# Altium schematic sheet 03_CONNECTOR.SchDoc: =TitleParameter
size A2; SPICEModelCacheRTZHBNFU: <root> / <DocumentId>RTZHBNFU</DocumentId> / </root>
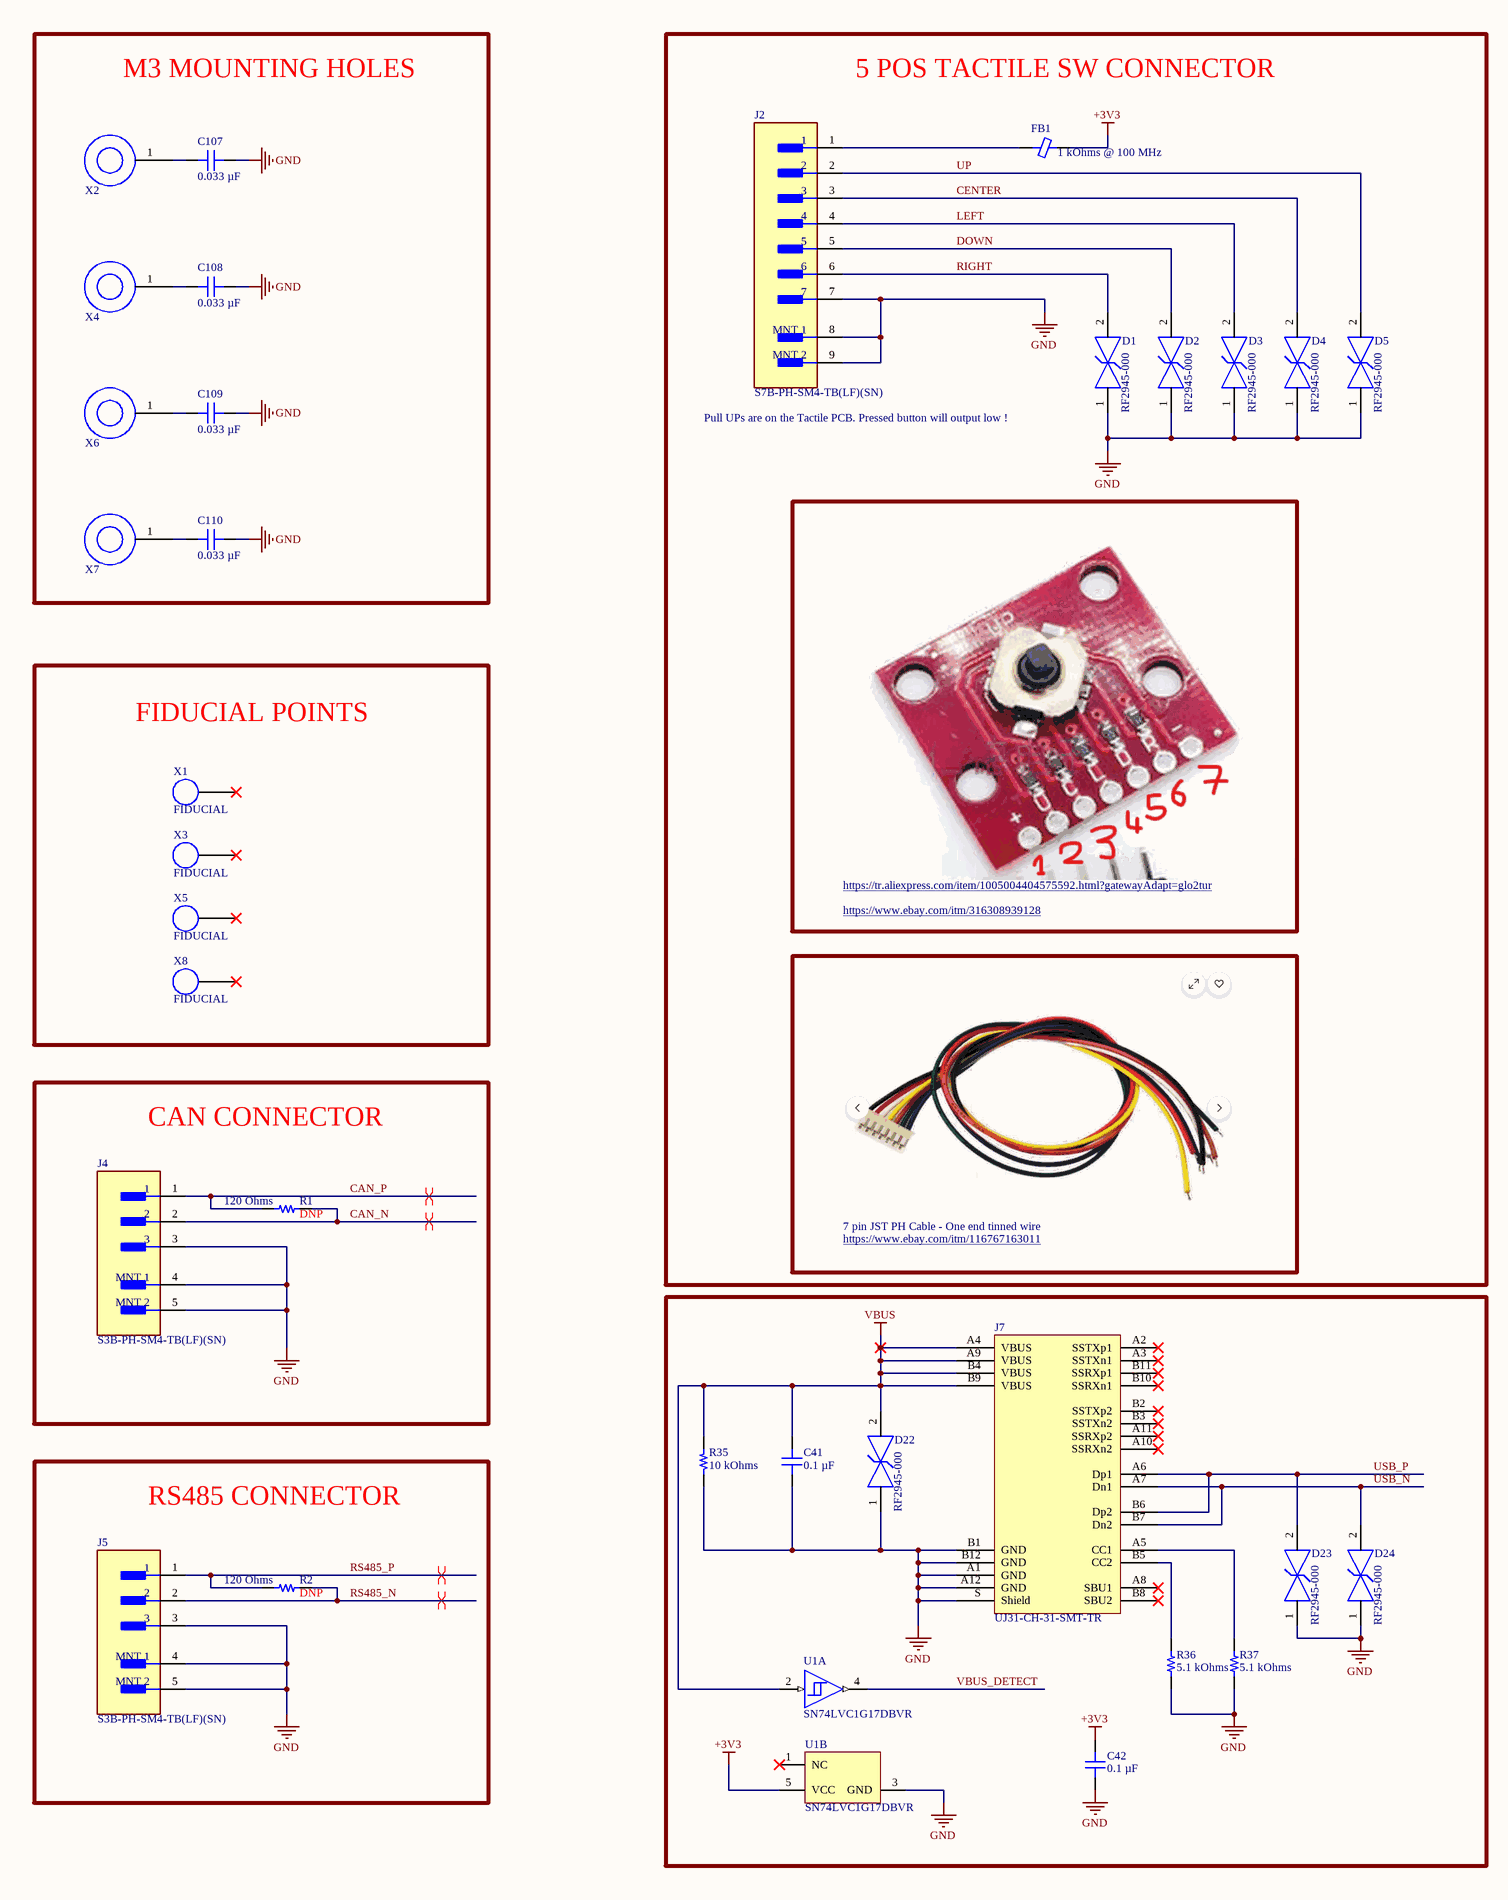
[diagram p0: 03_CONNECTOR.SchDoc, left]
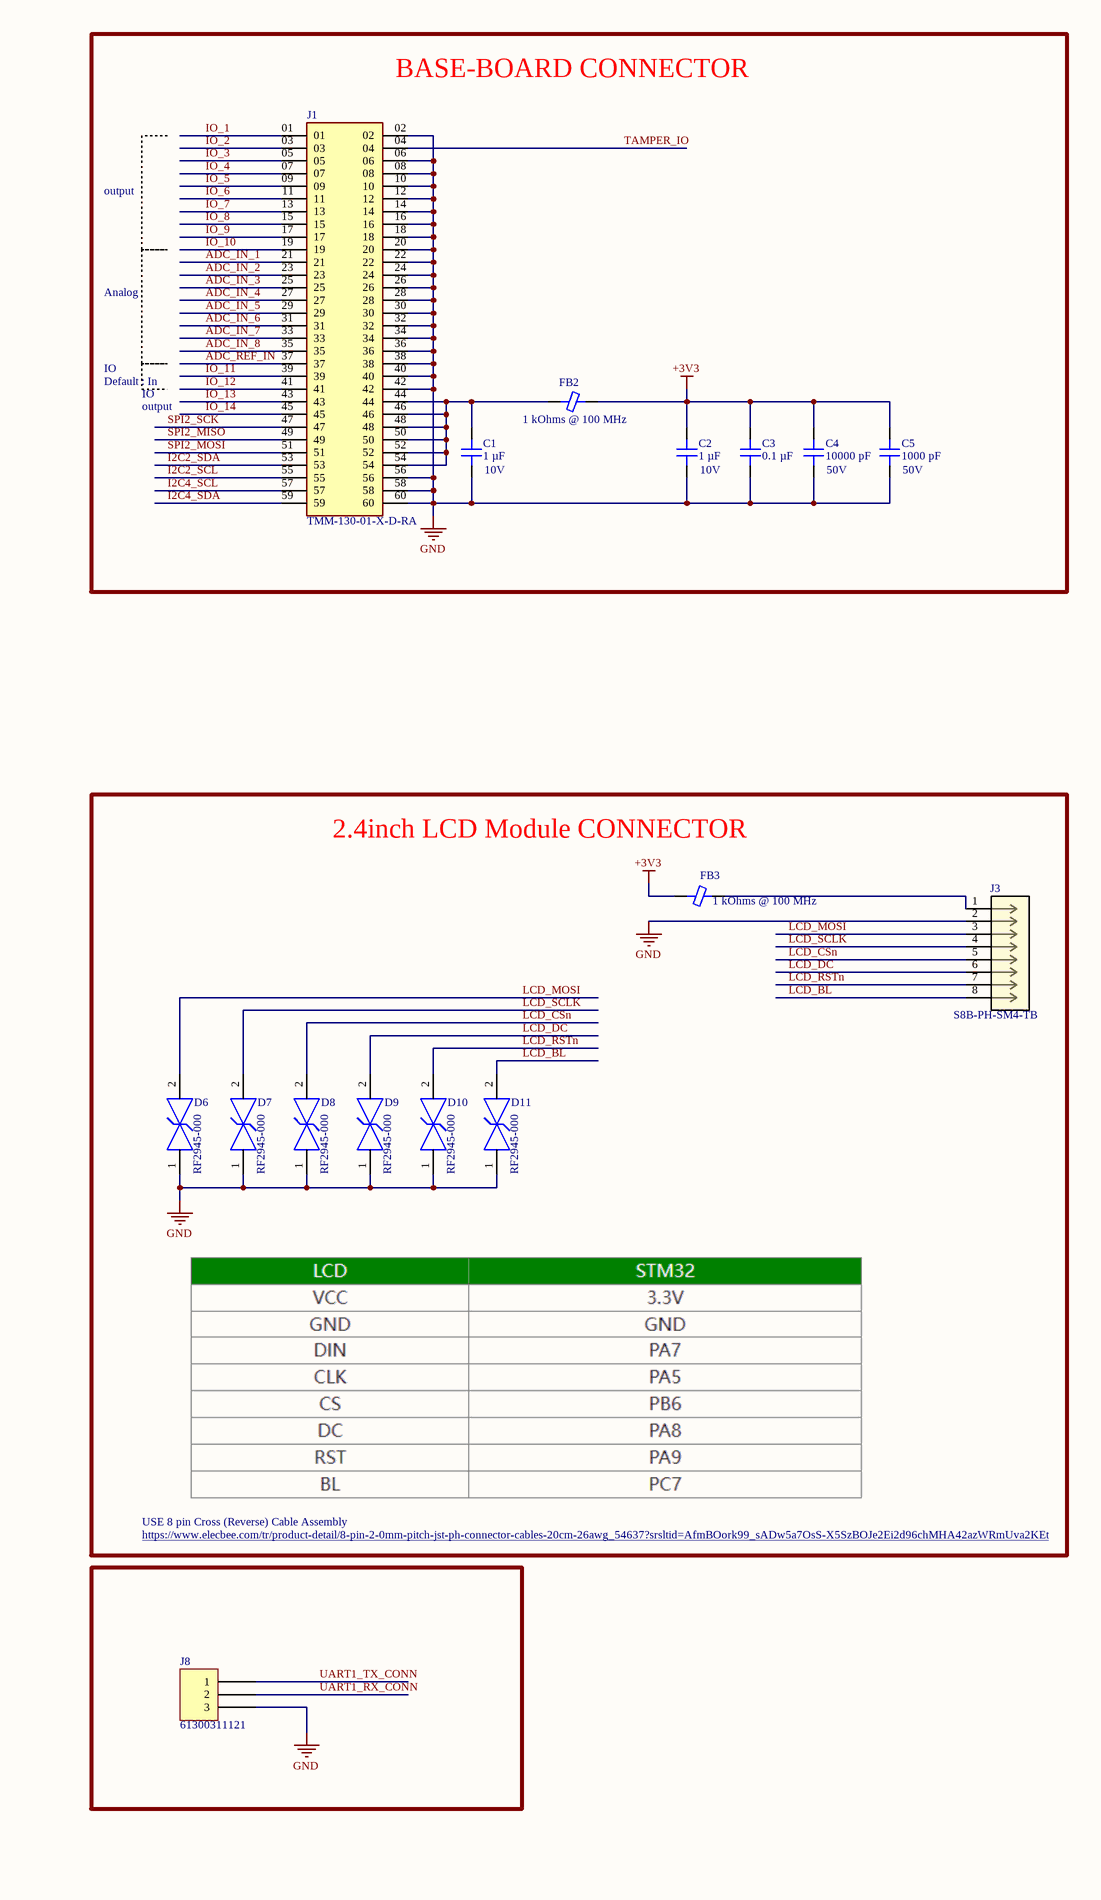
[diagram p1: 03_CONNECTOR.SchDoc, right]

## Parts
C1  Voltage - Rated: 10V  [CAP 0402_1005]  (hidden comment: 1 µF)
C2  Voltage - Rated: 10V  [CAP 0402_1005]  (hidden comment: 1 µF)
C3  0.1 µF  [MURATA GRM155 0402_1005]
C4  Voltage - Rated: 50V  [CAP 0402_1005]  (hidden comment: 10000 pF)
C5  Voltage - Rated: 50V  [CAP 0402_1005]  (hidden comment: 1000 pF)
C41  0.1 µF  [MURATA GRM155 0402_1005]
C42  0.1 µF  [MURATA GRM155 0402_1005]
C107  0.033 µF  [CAP 1210_3225 - 1MM]
C108  0.033 µF  [CAP 1210_3225 - 1MM]
C109  0.033 µF  [CAP 1210_3225 - 1MM]
C110  0.033 µF  [CAP 1210_3225 - 1MM]
D1  RF2945-000  [FP-SESD0402-MFG]
D2  RF2945-000  [FP-SESD0402-MFG]
D3  RF2945-000  [FP-SESD0402-MFG]
D4  RF2945-000  [FP-SESD0402-MFG]
D5  RF2945-000  [FP-SESD0402-MFG]
D6  RF2945-000  [FP-SESD0402-MFG]
D7  RF2945-000  [FP-SESD0402-MFG]
D8  RF2945-000  [FP-SESD0402-MFG]
D9  RF2945-000  [FP-SESD0402-MFG]
D10  RF2945-000  [FP-SESD0402-MFG]
D11  RF2945-000  [FP-SESD0402-MFG]
D22  RF2945-000  [FP-SESD0402-MFG]
D23  RF2945-000  [FP-SESD0402-MFG]
D24  RF2945-000  [FP-SESD0402-MFG]
FB1  1 kOhms @ 100 MHz  [FER 1206_3216]
FB2  1 kOhms @ 100 MHz  [FER 1206_3216]
FB3  1 kOhms @ 100 MHz  [FER 1206_3216]
J1  TMM-130-01-X-D-RA  [SAMTEC_TMM-130-01-X-D-RA]
J2  S7B-PH-SM4-TB(LF)(SN)  [FP-S7B-PH-SM4-TB_LF_SN-MFG]
J3  S8B-PH-SM4-TB  [CONN_S8B-PH-SM4-TB_JST]
J4  S3B-PH-SM4-TB(LF)(SN)  [FP-S3B-PH-SM4-TB_LF_SN-MFG]
J5  S3B-PH-SM4-TB(LF)(SN)  [FP-S3B-PH-SM4-TB_LF_SN-MFG]
J7  UJ31-CH-31-SMT-TR  [CUI UJ31-CH-31-SMT-TR]
J8  61300311121  [WURTH WE-PHD 61300311121]
R1  120 Ohms  [YAGEO RES 0805_2012]
R2  120 Ohms  [YAGEO RES 0805_2012]
R35  10 kOhms  [RES 0402_1005]
R36  5.1 kOhms  [YAGEO RES 0402_1005]
R37  5.1 kOhms  [YAGEO RES 0402_1005]
U1  SN74LVC1G17DBVR  [DBV0005A_L]  (parts A,B of 2)
X1  FIDUCIAL  [FIDUCIAL]  (no BOM)
X2  M3  [FIXING_M3]  (value not drawn)  (no BOM)
X3  FIDUCIAL  [FIDUCIAL]  (no BOM)
X4  M3  [FIXING_M3]  (value not drawn)  (no BOM)
X5  FIDUCIAL  [FIDUCIAL]  (no BOM)
X6  M3  [FIXING_M3]  (value not drawn)  (no BOM)
X7  M3  [FIXING_M3]  (value not drawn)  (no BOM)
X8  FIDUCIAL  [FIDUCIAL]  (no BOM)

## Blocks framed on the sheet
M3 MOUNTING HOLES: C107-C110 X2 X4 X6 X7
5 POS TACTILE SW CONNECTOR: D1-D5 FB1 J2
BASE-BOARD CONNECTOR: C1-C5 FB2 J1
FIDUCIAL POINTS: X1 X3 X5 X8
2.4inch LCD Module CONNECTOR: D6-D11 FB3 J3
CAN CONNECTOR: J4 R1
RS485 CONNECTOR: J5 R2

## Nets
+3V3: C2.2 C3.2 C4.2 C5.2 C42.2 FB1.2 FB2.2 FB3.1 U1.5(VCC)
GND: C1.1 C2.1 C3.1 C4.1 C5.1 C41.1 C42.1 C107.2 C108.2 C109.2 C110.2 D1.1 D2.1 D3.1 D4.1 D5.1 D6.1 D7.1 D8.1 D9.1 D10.1 D11.1 D22.1 D23.1 D24.1 J1.02 J1.06 J1.08 J1.10 J1.12 J1.14 J1.16 J1.18 J1.20 J1.22 J1.24 J1.26 J1.28 J1.30 J1.32 J1.34 J1.36 J1.38 J1.40 J1.42 J1.56 J1.58 J1.60 J2.7 J2.8(MNT_1) J2.9(MNT_2) J3.2 J4.3 J4.4(MNT_1) J4.5(MNT_2) J5.3 J5.4(MNT_1) J5.5(MNT_2) J7.A1(GND) J7.A12(GND) J7.B1(GND) J7.B12(GND) J7.S(Shield) J8.3 R35.2 R36.1 R37.1 U1.3(GND)
VBUS: C41.2 D22.2 J7.A4(VBUS) J7.A9(VBUS) J7.B4(VBUS) J7.B9(VBUS) R35.1 U1.2(A)
ADC_IN_1: J1.21
ADC_IN_2: J1.23
ADC_IN_3: J1.25
ADC_IN_4: J1.27
ADC_IN_5: J1.29
ADC_IN_6: J1.31
ADC_IN_7: J1.33
ADC_IN_8: J1.35
ADC_REF_IN: J1.37
CAN_N: J4.2 R1.2
CAN_P: J4.1 R1.1
CENTER: D4.2 J2.3
DOWN: D2.2 J2.5
I2C2_SCL: J1.55
I2C2_SDA: J1.53
I2C4_SCL: J1.57
I2C4_SDA: J1.59
IO_1: J1.01
IO_2: J1.03
IO_3: J1.05
IO_4: J1.07
IO_5: J1.09
IO_6: J1.11
IO_7: J1.13
IO_8: J1.15
IO_9: J1.17
IO_10: J1.19
IO_11: J1.39
IO_12: J1.41
IO_13: J1.43
IO_14: J1.45
LCD_BL: D11.2 J3.8
LCD_CSn: D8.2 J3.5
LCD_DC: D9.2 J3.6
LCD_MOSI: D6.2 J3.3
LCD_RSTn: D10.2 J3.7
LCD_SCLK: D7.2 J3.4
LEFT: D3.2 J2.4
RIGHT: D1.2 J2.6
RS485_N: J5.2 R2.2
RS485_P: J5.1 R2.1
SPI2_MISO: J1.49
SPI2_MOSI: J1.51
SPI2_SCK: J1.47
TAMPER_IO: J1.04
UART1_RX_CONN: J8.2
UART1_TX_CONN: J8.1
UP: D5.2 J2.2
USB_N: D24.2 J7.A7(Dn1) J7.B7(Dn2)
USB_P: D23.2 J7.A6(Dp1) J7.B6(Dp2)
VBUS_DETECT: U1.4(Y)
NetC1_2: C1.2 FB2.1 J1.44 J1.46 J1.48 J1.50 J1.52 J1.54
NetC107_1: C107.1 X2.1
NetC108_1: C108.1 X4.1
NetC109_1: C109.1 X6.1
NetC110_1: C110.1 X7.1
NetFB1_1: FB1.1 J2.1
NetFB3_2: FB3.2 J3.1
NetJ7_A5: J7.A5(CC1) R37.2
NetJ7_B5: J7.B5(CC2) R36.2

Not connected (* = marked no-connect by the designer): J7 A2(SSTXp1)* A3(SSTXn1)* A8(SBU1)* A10(SSRXn2)* A11(SSRXp2)* B2(SSTXp2)* B3(SSTXn2)* B8(SBU2)* B10(SSRXn1)* B11(SSRXp1)*; U1 1(NC)*; X1 1*; X3 1*; X5 1*; X8 1*

## Layout directives
differential pair: CAN_N, CAN_P, RS485_N, RS485_P

## Notes on the sheet
- output
- Analog
- IO
- Pull UPs are on the Tactile PCB. Pressed button will output low !
- Default : In
- https://tr.aliexpress.com/item/1005004404575592.html?gatewayAdapt=glo2tur
- https://www.ebay.com/itm/316308939128
- (near R1) DNP
- 7 pin JST PH Cable - One end tinned wire
- https://www.ebay.com/itm/116767163011
- USE 8 pin Cross (Reverse) Cable Assembly
- https://www.elecbee.com/tr/product-detail/8-pin-2-0mm-pitch-jst-ph-connector-cables-20cm-26awg_54637?srsltid=AfmBOork99_sADw5a7OsS-X5SzBOJe2Ei2d96chMHA42azWRmUva2KEt
- (near R2) DNP
- Proje/Project:
- Sayfa Adı/Document Name:
- Çizilme Tarihi/Drawing Date
- Son Güncelleme/Last Edit Date
- Umit KAYACIK
- Tasarlayan/Designed By
- Kontrol eden/Checked By
- Boyut/Size:
- Sayfa/Sheet:
- Revision:
- A3
- of
- Onaylayan/Approved By
- Varyant/Variant:
- Dil/Language:
- ENG

## Library data of the parts
C1 C2 = C1005X7S1A105K050BC: CAP CER 1UF 10V X7S 0402; manufacturer: TDK Corporation; Tolerance: ±10%; Part Number: C1005X7S1A105K050BC; Value: 1 µF; Applications: General Purpose; Capacitance: 1 µF; componentlink1description: Datasheet; componentlink1url: https://product.tdk.com/info/en/catalog/datasheets/mlcc_commercial_general_en.pdf?ref_disty=digikey; componentlink2description: DigiKey Link; componentlink2url: https://www.digikey.com/en/products/detail/tdk-corporation/C1005X7S1A105K050BC/3661576; Device Package: 0402 (1005 Metric); Features: Low ESL; lastupdated: 2/9/2024 8:04:17 PM; Lifecycle Status: Active; Minimum Order: 1; Mounting Type: Surface Mount, MLCC; Operating Temperature: -55°C ~ 125°C; Package / Case: 0402 (1005 Metric); packaging: TapeAndReel; partid: 34315; Part Status: Active; price: 0.03; series: C; Size / Dimension: 0.039" L x 0.020" W (1.00mm x 0.50mm); Supplier 1: DigiKey; Supplier Part Number 1: 445-9116-1-ND; Temperature Coefficient: X7S; Thickness (Max): 0.022" (0.55mm)
C3 C41 C42 = GRM155R71H104KE14J: CAP CER 0.1UF 50V X7R 0402; manufacturer: Murata Electronics; Tolerance: ±10%; Part Number: GRM155R71H104KE14J; Capacitance: 0.1 µF; Applications: General Purpose; componentlink1description: Datasheet; componentlink1url: https://search.murata.co.jp/Ceramy/image/img/A01X/G101/ENG/GRM155R71H104KE14-01.pdf; componentlink2description: DigiKey Link; componentlink2url: https://www.digikey.com/en/products/detail/murata-electronics/GRM155R71H104KE14J/4905180; Device Package: 0402 (1005 Metric); lastupdated: 7/23/2025 10:42:35 AM; Lifecycle Status: Active; Minimum Order: 1; Mounting Type: Surface Mount, MLCC; Operating Temperature: -55°C ~ 125°C; Package / Case: 0402 (1005 Metric); packaging: CutTape; partid: 4071; Part Status: Active; price: 0.01; series: GRM; Size / Dimension: 0.039" L x 0.020" W (1.00mm x 0.50mm); Supplier 1: DigiKey; Supplier Part Number 1: 490-13342-1-ND; Temperature Coefficient: X7R; Thickness (Max): 0.022" (0.55mm); value: 0.1 µF; Voltage - Rated: 50V
C4 = CC0402KRX7R9BB103: CAP CER 10000PF 50V X7R 0402; manufacturer: Yageo; Tolerance: ±10%; Part Number: CC0402KRX7R9BB103; Value: 10000 pF; Applications: General Purpose; Capacitance: 10000 pF; componentlink1description: Datasheet; componentlink1url: https://www.yageo.com/upload/media/product/productsearch/datasheet/mlcc/UPY-GPHC_X7R_6.3V-to-50V_18.pdf; componentlink2description: DigiKey Link; componentlink2url: https://www.digikey.com/en/products/detail/yageo/CC0402KRX7R9BB103/2103087; Device Package: 0402 (1005 Metric); lastupdated: 2/9/2024 8:04:30 PM; Lifecycle Status: Active; Minimum Order: 10; Mounting Type: Surface Mount, MLCC; Operating Temperature: -55°C ~ 125°C; Package / Case: 0402 (1005 Metric); packaging: CutTape; partid: 6681; Part Status: Active; price: 0.01; series: CC; Size / Dimension: 0.039" L x 0.020" W (1.00mm x 0.50mm); Supplier 1: DigiKey; Supplier Part Number 1: 311-1349-1-ND; Temperature Coefficient: X7R; Thickness (Max): 0.022" (0.55mm)
C5 = CC0402KRX7R9BB102: CAP CER 1000PF 50V X7R 0402; manufacturer: Yageo; Tolerance: ±10%; Part Number: CC0402KRX7R9BB102; Value: 1000 pF; Applications: General Purpose; Capacitance: 1000 pF; componentlink1description: Datasheet; componentlink1url: https://www.yageo.com/upload/media/product/productsearch/datasheet/mlcc/UPY-GPHC_X7R_6.3V-to-50V_18.pdf; componentlink2description: DigiKey Link; componentlink2url: https://www.digikey.com/en/products/detail/yageo/CC0402KRX7R9BB102/302770; Device Package: 0402 (1005 Metric); lastupdated: 2/9/2024 8:04:33 PM; Lifecycle Status: Active; Minimum Order: 10; Mounting Type: Surface Mount, MLCC; Operating Temperature: -55°C ~ 125°C; Package / Case: 0402 (1005 Metric); packaging: CutTape; partid: 4791; Part Status: Active; price: 0.01; series: CC; Size / Dimension: 0.039" L x 0.020" W (1.00mm x 0.50mm); Supplier 1: DigiKey; Supplier Part Number 1: 311-1036-1-ND; Temperature Coefficient: X7R; Thickness (Max): 0.022" (0.55mm)
C107-C110 = C1210X333KDRAC7800: CAP CER 0.033UF 1KV X7R 1210; manufacturer: KEMET; Tolerance: ±10%; Voltage - Rated: 1000V (1kV); Part Number: C1210X333KDRAC7800; Value: 0.033 µF; Applications: Boardflex Sensitive; Capacitance: 0.033 µF; componentlink1description: Datasheet; componentlink1url: https://api.kemet.com/component-edge/download/datasheet/C1210X333KDRACTU.pdf; componentlink2description: DigiKey Link; componentlink2url: https://www.digikey.com/en/products/detail/kemet/C1210X333KDRAC7800/3084039; Device Package: 1210 (3225 Metric); Features: Low ESL, Soft Termination, High Voltage; lastupdated: 04/06/2024 19:20:53; Lifecycle Status: Active; Minimum Order: 1; Mounting Type: Surface Mount, MLCC; Operating Temperature: -55°C ~ 125°C; Package / Case: 1210 (3225 Metric); packaging: TapeAndReel; partid: 29427; Part Status: Active; price: 0.17; series: SMD Comm X7R HV Flex; Size / Dimension: 0.130" L x 0.102" W (3.30mm x 2.60mm); Supplier 1: DigiKey; Supplier Part Number 1: 399-C1210X333KDRAC7800CT-ND; Temperature Coefficient: X7R; Thickness (Max): 0.067" (1.70mm)
D1-D11 D22-D24 = CMP-08607-000062-1: TVS DIODE 7V 10V 0402; Manufacturer: Littelfuse; Value: 0.1pF; Breakdown Voltage: 9.8V; Number Of Channels: 1; Peak Pulse Current: 2A; Direction: Bidirectional; Automotive Grade: Grade 1; Standoff Height: 0mm; Octopart: https://octopart.com/rf2945-000-littelfuse-56516902; Device Class L3: unset; ComponentLink2Description: Datasheet; Lead Free: Yes; Temperature Range Low: -55°C; Clamping Voltage: 10V; Digikey Description: TVS DIODE 7V 10V 0402; Category: Diode; Temperature: -55°C to +125°C; Device Class L1: Circuit Protection; Capacitance: 0.1pF; RoHS: TRUE; Device Class L2: TVS Diodes; Package: SESD0402; Reverse Standoff Voltage: 7V; Automotive: Yes; Height: 0.43mm; Manufacturer Part Number: RF2945-000; Temperature Range High: +125°C; ComponentLink2URL: https://www.littelfuse.com/~/media/electronics/datasheets/tvs_diode_arrays/littelfuse_tvs_diode_array_sesd_ultra_low_capacitance_discrete_tvs_datasheet.pdf.pdf
FB1-FB3 = BLM31KN102SN1L: FERRITE BEAD 1K OHM 1206 1LN; Manufacturer: Murata Electronics; Current Rating (Max): 2A; DC Resistance (DCR) (Max): 75mOhm; Filter Type: Power Line; Number of Lines: 1; Part Number: BLM31KN102SN1L; ComponentLink1Description: Datasheet; ComponentLink1URL: https://www.murata.com/en-global/products/productdata/8796739698718/ENFA0006.pdf; ComponentLink2Description: DigiKey Link; ComponentLink2URL: https://www.digikey.com/en/products/detail/murata-electronics/BLM31KN102SN1L/7564086; Device Package: 1206 (3216 Metric); Height (Max): 0.071" (1.80mm); Impedance @ Frequency: 1 kOhms @ 100 MHz; LastUpdated: 6/3/2024 7:52:37 PM; Lifecycle Status: Active; Minimum Order: 1; Mounting Type: Surface Mount; Operating Temperature: -55°C ~ 125°C; Package / Case: 1206 (3216 Metric); Packaging: TapeAndReel; PartId: 1659; Part Status: Active; Price: 0.10; Series: BLM; Size / Dimension: 0.126" L x 0.063" W (3.20mm x 1.60mm); Supplier 1: DigiKey; Supplier Part Number 1: 490-16521-1-ND; Value: 1 kOhms @ 100 MHz
J1 = TMM-130-01-X-D-RA: Connector Header Through Hole, Right Angle 60 position 0.079 (2.00mm); MF: Samtec; MP: TMM-130-01-L-D-RA; SnapEDA_Link: https://www.snapeda.com/parts/TMM-130-01-L-D-RA/Samtec/view-part/?ref=snap; Package: None; Value: *; Check_prices: https://www.snapeda.com/parts/TMM-130-01-L-D-RA/Samtec/view-part/?ref=eda
J2 = CMP-17439-000040-1: CONN HEADER SMD R/A 7POS 2MM; Connector Type: Male Pin; Working Voltage: 100V; Gender: Male; Current Rating: 2A; Number of Positions: 7; Contact Resistance: 20mR; Insulation Resistance: 1GR; Housing Color: Beige; Height: 9.4mm; Fastening Type: Detent; Color: Natural; Contact Plating: Tin; Max Current Rating: 2A; Pitch: 2mm; Voltage Rating (AC): 100V; REACH SVHC: No SVHC; Min Operating Temperature: -25°C; Number of Rows: 1; Width: 5mm; Voltage Rating: 100V; Max Voltage Rating (AC): 100V; Number of Contacts: 7; Lead Pitch: 2mm; Max Operating Temperature: 85°C; Contact Mating Length: 0.13inch; Contact Type: Male Pin; Orientation: Right Angle; Depth: 7.6mm; Contact Material: Copper Alloy; Lead Free: Lead Free; Mount: Surface Mount; Length: 17.9mm; Flammability Rating: UL94 V-0; Series: PH; Packaging: Tape and Reel; Number of Poles: 7; Termination: Solder; Housing Material: Polyamide
J3 = S8B-PH-SM4-TB: Description; Manufacturer_Name: JST; Copyright: Copyright (C) 2025 Ultra Librarian. All rights reserved.; Manufacturer_Part_Number: S8B-PH-SM4-TB; RefDes: RefDes; Type: Type; Supplier 1: Arrow Electronics; Supplier Part Number 1: S8B-PH-SM4-TB(LF)(SN)
J4 J5 = CMP-2000-07023-2: CONN HEADER SMD R/A 3POS 2MM; Voltage Rating: 100V; Gender: Male; Max Current Rating: 2A; Number of Contacts: 3; Insulation Resistance: 1GR; Contact Resistance: 10mR; Termination: Solder; Orientation: Right Angle; Insulation Color: Natural; Flammability Rating: UL94 V-0; Width: 5mm; Lead Free: Lead Free; Mount: Surface Mount; Max Operating Temperature: 85°C; Connector Type: Header; Fastening Type: Detent; Max Voltage Rating (DC): 100V; Housing Material: Polyamide; Number of Rows: 1; Housing Color: Beige; Contact Plating: Tin; Contact Shape: Square; Working Voltage: 100V; Contact Material: Copper Alloy; Contact Mating Length: 0.13inch; Contact Type: Male Pin; Max Voltage Rating (AC): 100V; Packaging: Tape and Reel; Min Operating Temperature: -25°C; Number of Positions: 3; REACH SVHC: No SVHC; Contact Finish - Mating: TIN; Color: Natural; Length: 9.9mm; Insulation Material: Nylon; Depth: 7.6mm; Current Rating: 2A; Material: Polyamide; Voltage Rating (AC): 100V; Pitch: 2mm; Series: PH; Height: 9.4mm; Number of Poles: 3; Lead Pitch: 2mm
J7 = UJ31-CH-31-SMT-TR: CONN RCPT USB3.1 TYPEC 24POS R/A; Manufacturer: CUI Devices; Connector Type: USB - C (Type - C); Current Rating (Amps): 0.25A, 1.25A, 5A, 6.25A; Gender: Receptacle; Mating Cycles: 10000; Number of Contacts: 24; Number of Ports: 1; Shielding: Shielded; Specifications: USB 3.1 (USB 3.1 Gen 2, Superspeed+); Voltage - Rated: 20V; Part Number: UJ31-CH-31-SMT-TR; ComponentLink1Description: Datasheet; ComponentLink1URL: https://www.cuidevices.com/product/resource/digikeypdf/uj31-ch-smt.pdf; ComponentLink2Description: DigiKey Link; ComponentLink2URL: http://digikey.com/product-detail/en/cui-devices/UJ31-CH-31-SMT-TR/102-4485-1-ND/8024065; Features: Board Guide; LastUpdated: 5/24/2020 10:49:54 PM; Lifecycle Status: Active; Minimum Order: 1; Mounting Feature: Horizontal; Mounting Type: Surface Mount, Right Angle; Through Hole; Operating Temperature: -30°C ~ 85°C; Packaging: TapeAndReel; Part Status: Active; Price: 0.89; Series: UJ31; Supplier 1: DigiKey; Supplier Part Number 1: 102-4485-1-ND; Termination: Solder
J8 = 61300311121: CONN HEADER VERT 3POS 2.54MM; Manufacturer: Würth Elektronik; Contact Length - Mating: 0.236" (6.00mm); Contact Length - Post: 0.118" (3.00mm); Current Rating (Amps): 3A; Material Flammability Rating: UL94 V-0; Number of Positions: 3; Number of Positions Loaded: All; Overall Contact Length: 0.454" (11.54mm); Pitch - Mating: 0.100" (2.54mm); Row Spacing - Mating: -40°C ~ 105°C; Shrouding: Unshrouded; Style: Board to Board or Cable; Part Number: 61300311121; ComponentLink1Description: Datasheet; ComponentLink1URL: https://katalog.we-online.de/em/datasheet/6130xx11121.pdf; ComponentLink2Description: DigiKey Link; ComponentLink2URL: https://www.digikey.com/en/products/detail/würth-elektronik/61300311121/4846825; Connector Type: Header; Contact Finish - Mating: Gold; Contact Material: Copper Alloy; Contact Shape: Square; Contact Type: Male Pin; Fastening Type: Push-Pull; Insulation Color: Black; Insulation Height: 0.100" (2.54mm); Insulation Material: Polyamide (PA6T), Nylon 6T; LastUpdated: 10/18/2024 1:43:15 PM; Lifecycle Status: Active; Minimum Order: 1; Mounting Type: Through Hole; Number of Rows: 1; Operating Temperature: -40°C ~ 105°C; Packaging: Bulk; PartId: 189; Part Status: Active; Price: 0.07; Series: WR-PHD; Supplier 1: DigiKey; Supplier Part Number 1: 732-5316-ND; Termination: Solder
R1 R2 = RC0805FR-07120RL: RES 120 OHM 1% 1/8W 0805; Manufacturer: Yageo; Power (Watts): 0.125W, 1/8W; Temperature Coefficient: ±100ppm/°C; Part Number: RC0805FR-07120RL; Value: 120 Ohms; ComponentLink1Description: Datasheet; ComponentLink1URL: https://www.yageo.com/upload/media/product/productsearch/datasheet/rchip/PYu-RC_Group_51_RoHS_L_10.pdf; ComponentLink2Description: DigiKey Link; ComponentLink2URL: https://www.digikey.com/en/products/detail/yageo/RC0805FR-07120RL/727575; Composition: Thick Film; Device Package: 0805 (2012 Metric); Features: Moisture Resistant; Height - Seated (Max): 0.024" (0.60mm); LastUpdated: 7/25/2024 9:20:22 AM; Lifecycle Status: Active; Minimum Order: 1; Number of Terminations: 2; Operating Temperature: -55°C ~ 155°C; Package / Case: 0805 (2012 Metric); Packaging: TapeAndReel; PartId: 39440; Part Status: Active; Price: 0.01; Resistance: 120 Ohms; Series: RC_L; Size / Dimension: 0.079" L x 0.049" W (2.00mm x 1.25mm); Supplier 1: DigiKey; Supplier Part Number 1: 311-120CRCT-ND; Supplier Device Package: 0805; Tolerance: ±1%
R35 = RC0402FR-0710KL: RES 10K OHM 1% 1/16W 0402; Manufacturer: Yageo; Power (Watts): 0.063W, 1/16W; Temperature Coefficient: ±100ppm/°C; Part Number: RC0402FR-0710KL; Value: 10 kOhms; ComponentLink1Description: Datasheet; ComponentLink1URL: https://www.yageo.com/upload/media/product/productsearch/datasheet/rchip/PYu-RC_Group_51_RoHS_L_10.pdf; ComponentLink2Description: DigiKey Link; ComponentLink2URL: https://www.digikey.com/en/products/detail/yageo/RC0402FR-0710KL/726523; Composition: Thick Film; Device Package: 0402 (1005 Metric); Features: Moisture Resistant; Height - Seated (Max): 0.016" (0.40mm); LastUpdated: 30.04.2023 19:24:29; Lifecycle Status: Active; Minimum Order: 1; Number of Terminations: 2; Operating Temperature: -55°C ~ 155°C; Package / Case: 0402 (1005 Metric); Packaging: CutTape; PartId: 17593; Part Status: Active; Price: 0.01; Resistance: 10 kOhms; Series: RC_L; Size / Dimension: 0.039" L x 0.020" W (1.00mm x 0.50mm); Supplier 1: DigiKey; Supplier Part Number 1: 311-10.0KLRCT-ND; Supplier Device Package: 0402; Tolerance: ±1%
R36 R37 = RC0402FR-075K1L: RES 5.1K OHM 1% 1/16W 0402; Manufacturer: Yageo; Power (Watts): 0.063W, 1/16W; Temperature Coefficient: ±100ppm/°C; Part Number: RC0402FR-075K1L; Value: 5.1 kOhms; ComponentLink1Description: Datasheet; ComponentLink1URL: https://www.yageo.com/upload/media/product/productsearch/datasheet/rchip/PYu-RC_Group_51_RoHS_L_10.pdf; ComponentLink2Description: DigiKey Link; ComponentLink2URL: https://www.digikey.com/en/products/detail/yageo/RC0402FR-075K1L/726624; Composition: Thick Film; Device Package: 0402 (1005 Metric); Features: Moisture Resistant; Height - Seated (Max): 0.016" (0.40mm); LastUpdated: 8/31/2025 3:04:04 PM; Lifecycle Status: Active; Minimum Order: 1; Number of Terminations: 2; Operating Temperature: -55°C ~ 155°C; Package / Case: 0402 (1005 Metric); Packaging: CutTape; PartId: 17937; Part Status: Active; Price: 0.01; Resistance: 5.1 kOhms; Series: RC_L; Size / Dimension: 0.039" L x 0.020" W (1.00mm x 0.50mm); Supplier 1: DigiKey; Supplier Part Number 1: 311-5.10KLRCT-ND; Supplier Device Package: 0402; Tolerance: ±1%
U1 = CMP-0859-00033-4: Single Schmitt-Trigger Buffer, DBV0005A, LARGE T&R; Manufacturer: Texas Instruments; Output Drive (IOL/IOH)(Max)(mA): 32/-32; Technology Family: LVC; ICC @ Nom Voltage(Max)(mA): 0.01; VCC(Min)(V): 1.65; F @ Nom Voltage(Max)(Mhz): 150; Schmitt Trigger: Yes; Voltage(Nom)(V): 1.8,2.5,3.3,5; 3-State Output: No; Bits(#): 1; VCC(Max)(V): 5.5; Input Type: CMOS/TTL; Logic: True; tpd @ Nom Voltage(Max)(ns): 11,6.5,5.5,5; Output Type: CMOS; Rating: Catalog; Sub-Family: Non-Inverting Buffer/Driver; PackageReference: DBV0005A; DatasheetVersion: SCES351V; Generic Part Number: SN74LVC1G17; Operating Temperature Range(C): -40 to 125,-40 to 85
X1 X3 X5 X8 = FIDUCIAL: FIDUCIAL 1mm
X2 X4 X6 X7 = FIXING_M3: FIXING HOLE M3; Value: M3